# Altium schematic sheet Esquemático entero.SchDoc
size A4
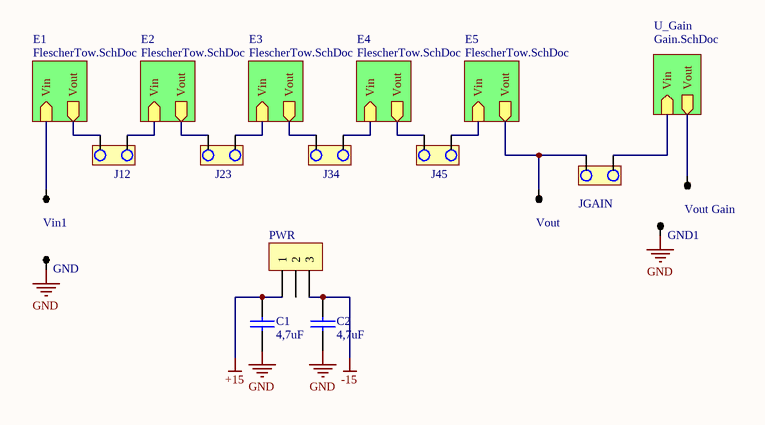
[diagram p0: Esquemático entero.SchDoc]

## Parts
C1  4,7uF  [0805]
C2  4,7uF  [0805]
GND  TP  [TPTH]  (value not drawn)
GND1  TP  [TPTH]  (value not drawn)
J12  Connect  [JUMPER2]  (value not drawn)
J23  Connect  [JUMPER2]  (value not drawn)
J34  Connect  [JUMPER2]  (value not drawn)
J45  Connect  [JUMPER2]  (value not drawn)
JGAIN  JUMPER  [JUMPER2]  (value not drawn)
PWR  (no value)  [BORNERA3]
Vin1  TP  [TPTH]  (value not drawn)
Vout  TP  [TPTH]  (value not drawn)
Vout_Gain  TP  [TPTH]  (value not drawn)

## Sub-sheets
E1 = FlescherTow.SchDoc: Vin (in), Vout (out)
E2 = FlescherTow.SchDoc: Vin (in), Vout (out)
E3 = FlescherTow.SchDoc: Vin (in), Vout (out)
E4 = FlescherTow.SchDoc: Vin (in), Vout (out)
E5 = FlescherTow.SchDoc: Vin (in), Vout (out)
U_Gain = Gain.SchDoc: Vin (in), Vout (out)

## Nets
+15: C1.2 PWR.1
-15: C2.2 PWR.3
GND: C1.1 C2.1 GND.1 GND1.1
NetJ12_1: J12.1 ; sheet E1/Vout
NetJ12_2: J12.2 ; sheet E2/Vin
NetJ23_1: J23.1 ; sheet E2/Vout
NetJ23_2: J23.2 ; sheet E3/Vin
NetJ34_1: J34.1 ; sheet E3/Vout
NetJ34_2: J34.2 ; sheet E4/Vin
NetJ45_1: J45.1 ; sheet E4/Vout
NetJ45_2: J45.2 ; sheet E5/Vin
NetJGAIN_1: JGAIN.1 Vout.1 ; sheet E5/Vout
NetJGAIN_2: JGAIN.2 ; sheet U_Gain/Vin
NetVin1_1: Vin1.1 ; sheet E1/Vin
NetVout_Gain_1: Vout_Gain.1 ; sheet U_Gain/Vout

Not connected (* = marked no-connect by the designer): PWR 2

## Library data of the parts
C1 C2 = CAP
J12 J23 J34 J45 = JUMPER
PWR = BORNERA 3